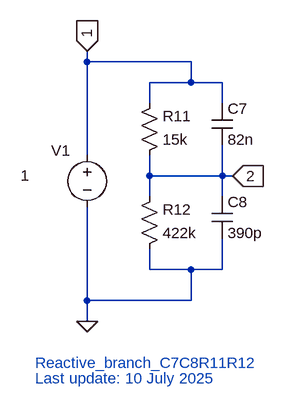
[diagram p0: schematic Reactive_branch_C7C8R11R12.asc]
Reactive_branch_C7C8R11R12.asc, the LTspice schematic file:
Version 4
SHEET 1 4496 5064
WIRE 80 2448 80 2432
WIRE 240 2448 80 2448
WIRE 240 2480 240 2448
WIRE 240 2480 176 2480
WIRE 288 2480 240 2480
WIRE 176 2512 176 2480
WIRE 288 2512 288 2480
WIRE 80 2592 80 2448
WIRE 176 2624 176 2592
WIRE 288 2624 288 2576
WIRE 288 2624 176 2624
WIRE 304 2624 288 2624
WIRE 176 2656 176 2624
WIRE 288 2656 288 2624
WIRE 176 2768 176 2736
WIRE 240 2768 176 2768
WIRE 288 2768 288 2720
WIRE 288 2768 240 2768
WIRE 80 2816 80 2672
WIRE 240 2816 240 2768
WIRE 240 2816 80 2816
WIRE 80 2848 80 2816
FLAG 80 2432 1
IOPIN 80 2432 In
FLAG 80 2848 0
FLAG 304 2624 2
IOPIN 304 2624 In
SYMBOL voltage 80 2576 R0
WINDOW 0 -55 9 Left 2
WINDOW 39 0 0 Left 0
WINDOW 3 -102 47 Left 2
SYMATTR InstName V1
SYMATTR Value 1
SYMATTR Value2 AC 1 0
SYMBOL res 160 2608 M180
WINDOW 0 36 76 Left 2
WINDOW 3 36 40 Left 2
SYMATTR InstName R11
SYMATTR Value 15k
SYMBOL cap 272 2576 M180
WINDOW 0 24 56 Left 2
WINDOW 3 24 8 Left 2
SYMATTR InstName C7
SYMATTR Value 82n
SYMBOL cap 272 2720 M180
WINDOW 0 24 56 Left 2
WINDOW 3 24 8 Left 2
SYMATTR InstName C8
SYMATTR Value 390p
SYMBOL res 160 2752 M180
WINDOW 0 36 76 Left 2
WINDOW 3 36 40 Left 2
SYMATTR InstName R12
SYMATTR Value 422k
TEXT 0 2912 Left 2 ;Reactive_branch_C7C8R11R12
TEXT 0 2936 Left 2 ;Last update: 10 July 2025

The netlist it stands for:
* Reactive_branch_C7C8R11R12.asc
V1 1 0 1 AC 1 0
R11 2 1 15k
C7 2 1 82n
C8 0 2 390p
R12 0 2 422k
* Reactive_branch_C7C8R11R12
* Last update: 10 July 2025
.backanno
.end